# EAGLE schematic core XX4 THT (EAGLE 6.2)
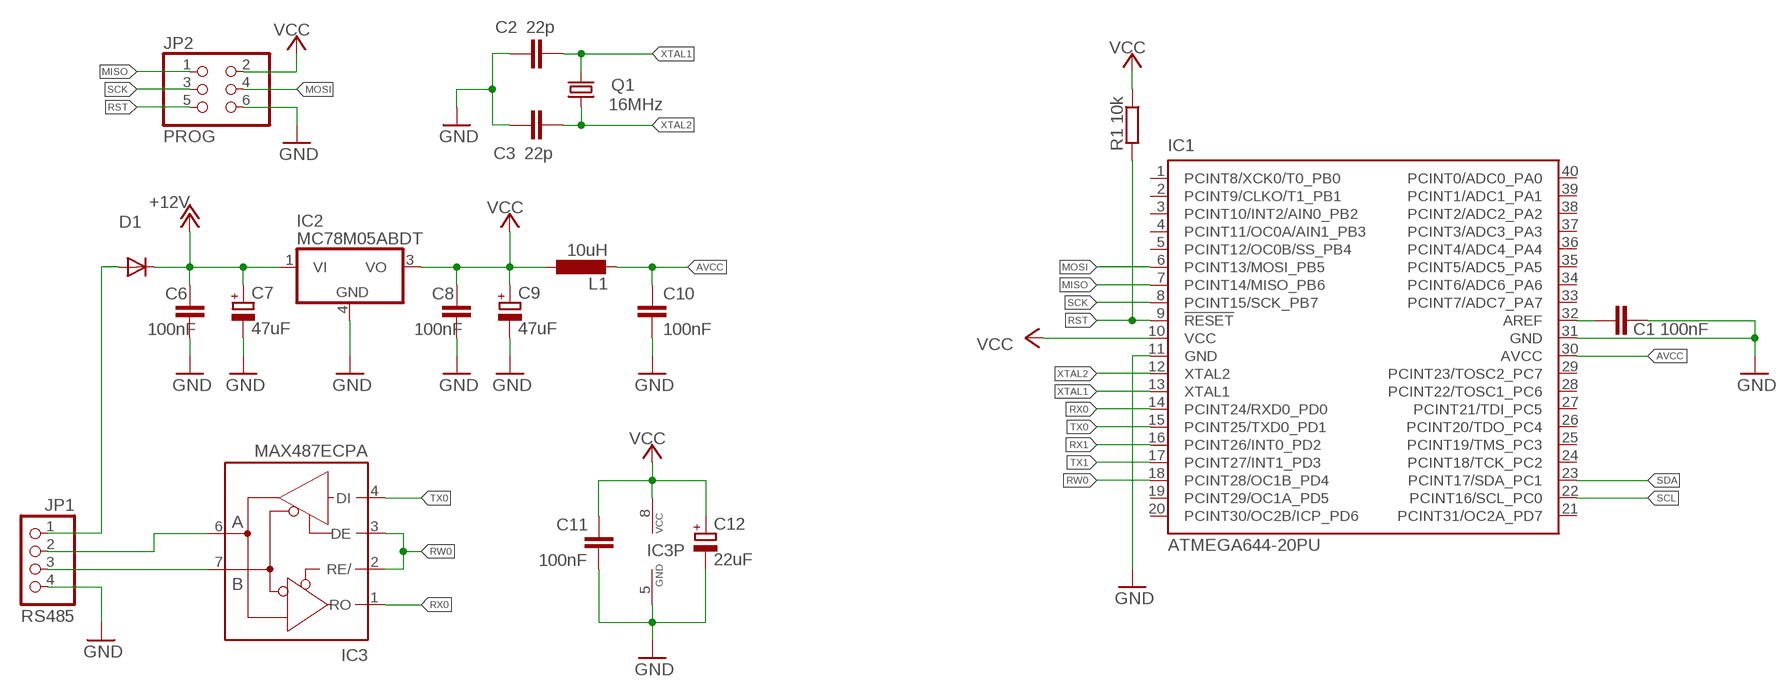
[diagram p0: schematic, sheet 1]

## Parts
C1  100nF  C-EU025-025X050  [C025-025X050]
C2  22p  C-EU025-024X044  [C025-024X044]
C3  22p  C-EU025-024X044  [C025-024X044]
C6  100nF  C-EU025-025X050  [C025-025X050]
C7  47uF  CPOL-EUE2.5-6  [E2,5-6]
C8  100nF  C-EU025-025X050  [C025-025X050]
C9  47uF  CPOL-EUE2.5-6  [E2,5-6]
C10  100nF  C-EU025-025X050  [C025-025X050]
C11  100nF  C-EU025-025X050  [C025-025X050]
C12  22uF  CPOL-EUE2-5  [E2-5]
D1  1N4002  BAS15  [DO34-7]
IC1  ATMEGA644-20PU  [DIL40]
IC2  MC78M05ABDT  [DPACK_3]
IC3  MAX487ECPA  MAX481CPA  [DIL08]
JP1  RS485  PINHD-1X4  [1X04]
JP2  PROG  PINHD-2X3  [2X03]
L1  10uH  L-EU0207/12  [0207/12]
Q1  16MHz  CRYSTALHC49S  [HC49/S]
R1  10k  R-EU_0204/2V  [0204V]

## Nets
+12V: C6.1 C7.+ D1.C IC2.1(VI)
AVCC: C10.1 IC1.30(AVCC) L1.2
GND: C1.2 C2.1 C3.1 C6.2 C7.- C8.2 C9.- C10.2 C11.2 C12.- IC1.11(GND) IC1.31(GND) IC2.4(GND) IC3.5(GND) JP1.4 JP2.6
MISO: IC1.7(PCINT14/MISO_PB6) JP2.1
MOSI: IC1.6(PCINT13/MOSI_PB5) JP2.4
N$3: D1.A JP1.1
N$4: IC3.7(B) JP1.3
N$5: IC3.6(A) JP1.2
N$7: C1.1 IC1.32(AREF)
RST: IC1.9(!RESET) JP2.5 R1.2
RW0: IC1.18(PCINT28/OC1B_PD4) IC3.2(RE/) IC3.3(DE)
RX0: IC1.14(PCINT24/RXD0_PD0) IC3.1(RO)
RX1: IC1.16(PCINT26/INT0_PD2)
SCK: IC1.8(PCINT15/SCK_PB7) JP2.3
SCL: IC1.22(PCINT16/SCL_PC0)
SDA: IC1.23(PCINT17/SDA_PC1)
TX0: IC1.15(PCINT25/TXD0_PD1) IC3.4(DI)
TX1: IC1.17(PCINT27/INT1_PD3)
VCC: C8.1 C9.+ C11.1 C12.+ IC1.10(VCC) IC2.3(VO) IC3.8(VCC) JP2.2 L1.1 R1.1
XTAL1: C2.2 IC1.13(XTAL1) Q1.2
XTAL2: C3.2 IC1.12(XTAL2) Q1.1
Unconnected: IC1.1(PCINT8/XCK0/T0_PB0) IC1.2(PCINT9/CLKO/T1_PB1) IC1.3(PCINT10/INT2/AIN0_PB2) IC1.4(PCINT11/OC0A/AIN1_PB3) IC1.5(PCINT12/OC0B/SS_PB4) IC1.19(PCINT29/OC1A_PD5) IC1.20(PCINT30/OC2B/ICP_PD6) IC1.21(PCINT31/OC2A_PD7) IC1.24(PCINT18/TCK_PC2) IC1.25(PCINT19/TMS_PC3) IC1.26(PCINT20/TDO_PC4) IC1.27(PCINT21/TDI_PC5) IC1.28(PCINT22/TOSC1_PC6) IC1.29(PCINT23/TOSC2_PC7) IC1.33(PCINT7/ADC7_PA7) IC1.34(PCINT6/ADC6_PA6) IC1.35(PCINT5/ADC5_PA5) IC1.36(PCINT4/ADC4_PA4) IC1.37(PCINT3/ADC3_PA3) IC1.38(PCINT2/ADC2_PA2) IC1.39(PCINT1/ADC1_PA1) IC1.40(PCINT0/ADC0_PA0)

## Library data of the parts
C1-C3 C6 C8 C10 C11 = rcl:C-EU: CAPACITOR, European symbol
C7 C9 C12 = rcl:CPOL-EU: POLARIZED CAPACITOR, European symbol
D1 = diode:BAS15: DIODE high speed
IC1 = atmel:ATMEGA644-*PU: 8-bit Microcontroller with 64K Bytes In-System Programmable Flash Auto generated by make-symbol-device-package-bsdl.ulp Rev. 34 Source: http://www.atmel.com/dyn/resources/prod_documents/doc2593.pdf; MPN: ATMEGA644-20PU; OC_FARNELL: 1288340; OC_NEWARK: 23M5060
IC2 = linear:MC78M: 500 mA Positive Voltage Regulators Source: Data sheet <http://www.onsemi.com/pub_link/Collateral/MC78M00-D.PDF>
IC3 = maxim:MAX481CPA: RS485 TRANSEIVER; MPN: MAX481CPA+; OC_FARNELL: unknown; OC_NEWARK: 99K3445
JP1 = pinhead:PINHD-1X4: PIN HEADER
JP2 = pinhead:PINHD-2X3: PIN HEADER
L1 = rcl:L-EU: INDUCTOR, European symbol
Q1 = crystal:CRYSTAL: CRYSTAL; OC_FARNELL: 1667008; OC_NEWARK: unknown
R1 = rcl:R-EU_: RESISTOR, European symbol